# Altium schematic sheet SWAP_21DK_ LV_SR_Brush_Rev1.0.SchDoc
size Letter
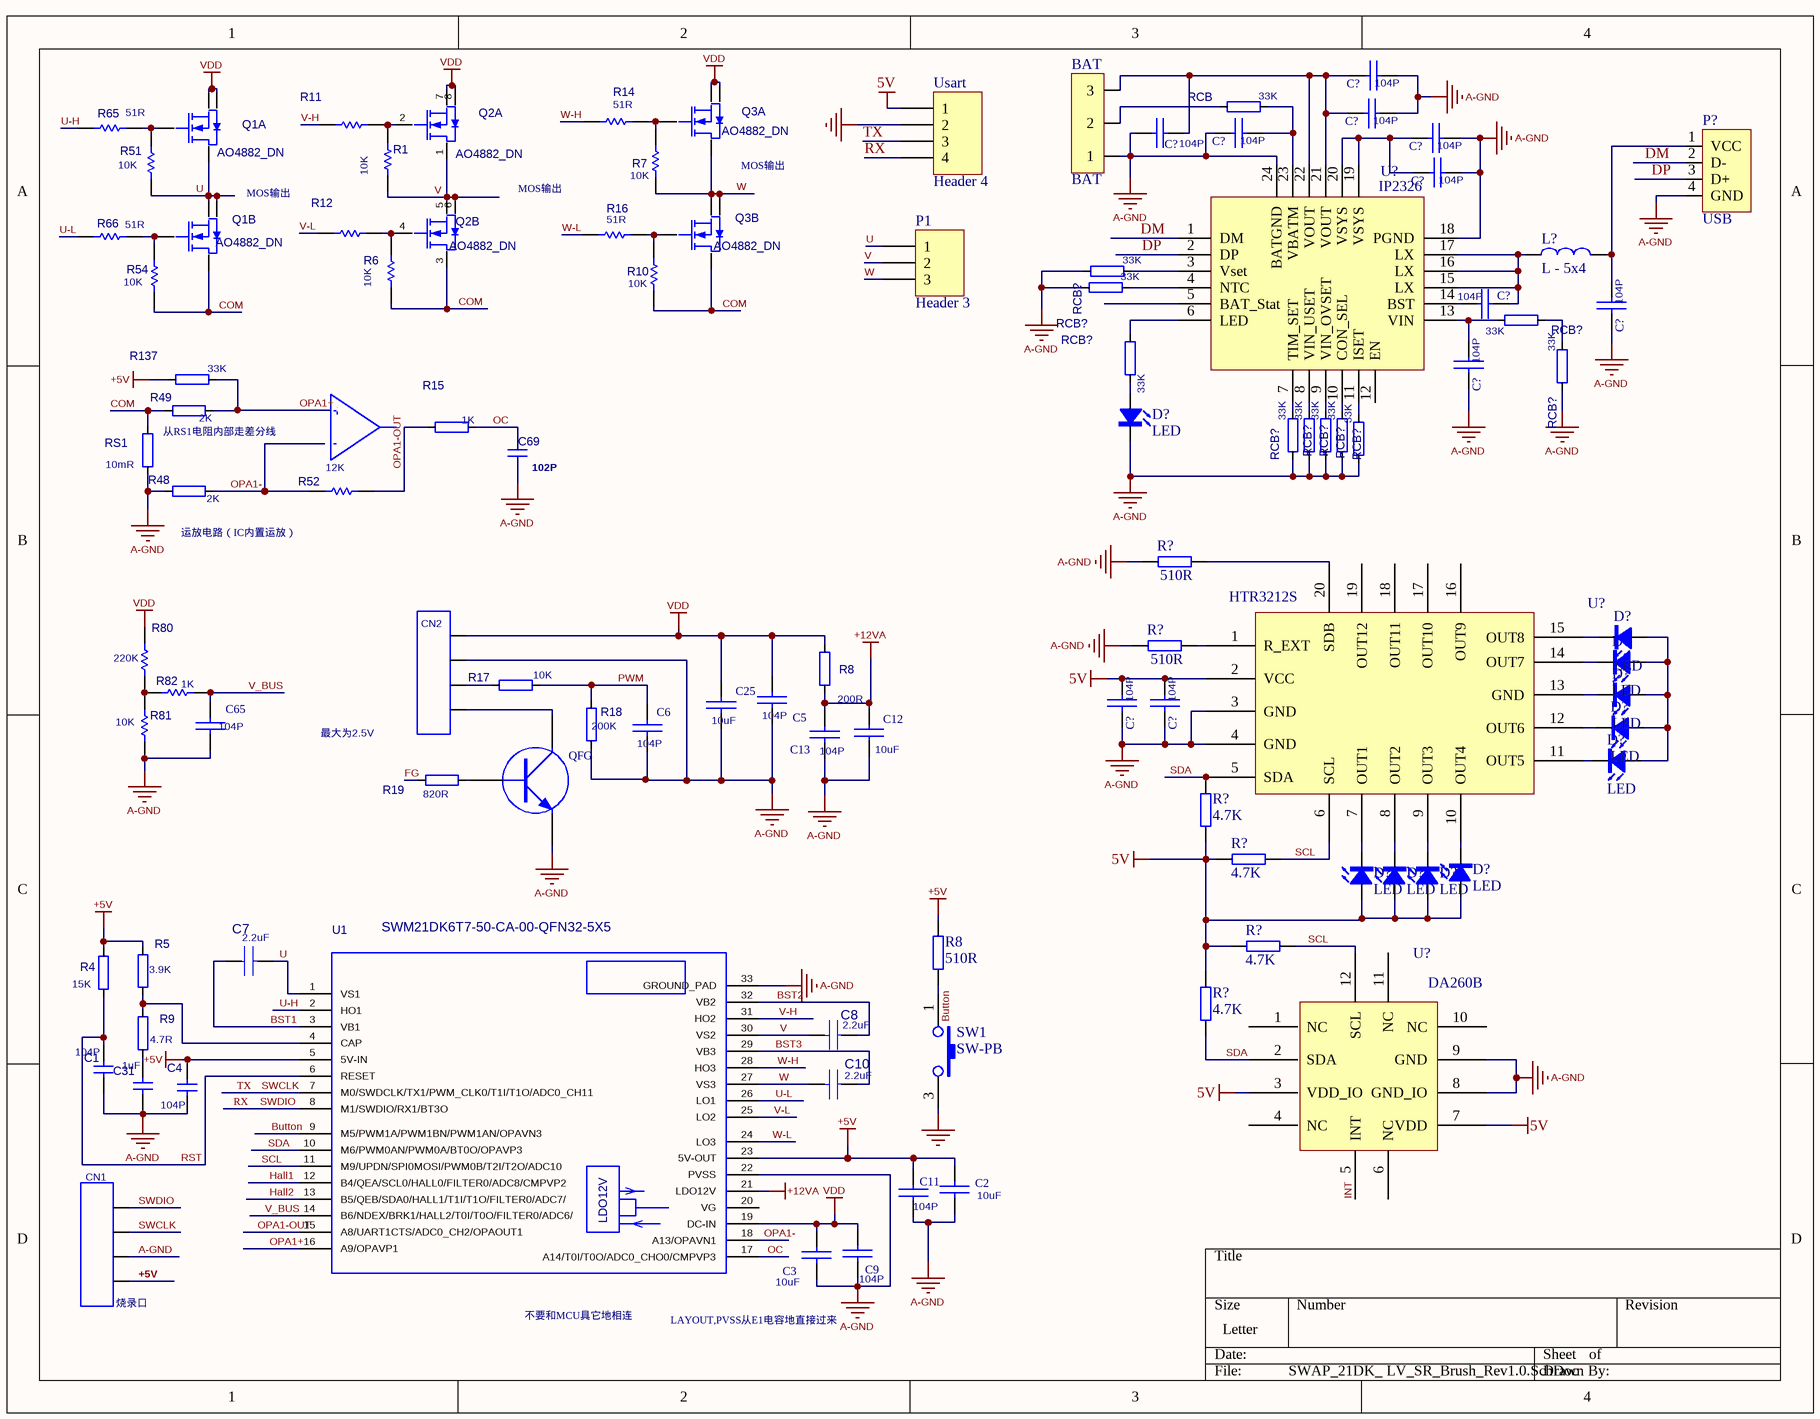
[diagram p0: SWAP_21DK_ LV_SR_Brush_Rev1.0.SchDoc]

## Parts
(Parts that share a designator on the sheet are numbered #1, #2 ... from top to bottom, then left to right.)
BAT  BAT  [HDR1X3]
C1  104P  [LC-0603_R]
C2  10uF  [LC-0603_R]
C3  10uF  [LC-0805_C]
C4  104P  [LC-0603_R]
C5  104P  [LC-0603_R]
C6  104P  [LC-0603_R]
C7  2.2uF  [LC-0603_C]
C8  2.2uF  [LC-0603_C]
C9  104P  [LC-0603_R]
C10  2.2uF  [LC-0603_C]
C11  104P  [LC-0603_R]
C12  10uF  [LC-0603_R]
C13  104P  [LC-0603_R]
C25  10uF  [LC-1206_C]
C31  1uF  [LC-0603_R]
C65  104P  [LC-0603_R]
C69  102P  [LC-0603_R]
C?#1  104P  [LC-0603_R]
C?#2  104P  [LC-0603_R]
C?#3  104P  [LC-0603_R]
C?#4  104P  [LC-0603_R]
C?#5  104P  [LC-0603_R]
C?#6  104P  [LC-0603_R]
C?#7  104P  [LC-0603_R]
C?#8  104P  [LC-0603_R]
C?#9  104P  [LC-0603_R]
C?#10  104P  [LC-0603_R]
C?#11  104P  [LC-0603_R]
CN1  4P-2.54-8B  [HDR2.54-LI-4P]  (value not drawn)
CN2  4P-2.54-8A  [XH2.54-LI-4P]  (value not drawn)
D?#1  LED  [D0603-B]
D?#2  LED  [D0603-B]
D?#3  LED  [D0603-B]
D?#4  LED  [D0603-B]
D?#5  LED  [D0603-B]
D?#6  LED  [D0603-B]
D?#7  LED  [D0603-B]
D?#8  LED  [D0603-B]
D?#9  LED  [D0603-B]
D?#10  LED  [D0603-B]
L?  L - 5x4  [L-5X4]
P1  Header 3  [VH3.96-LI-3P]
P?  USB  [mini_USB]
Q1  AO4882_DN  [LC-SOP-8_150mil]  (parts A,B of 2)
Q2  AO4882_DN  [LC-SOP-8_150mil]  (parts A,B of 2)
Q3  AO4882_DN  [LC-SOP-8_150mil]  (parts A,B of 2)
QFG  NPN 8050  [LC-SOT-23(SOT-23-3)]  (value not drawn)
R1  10K  [LC-0603_R]
R4  15K  [LC-0603_R]
R5  3.9K  [LC-0603_R]
R6  10K  [LC-0603_R]
R7  10K  [LC-0603_R]
R8#1  200R  [LC-1206_R]
R8#2  510R  [R 0603]
R9  4.7R  [LC-0603_R]
R10  10K  [LC-0603_R]
R11  51R  [LC-0603_R]  (value not drawn)
R12  51R  [LC-0603_R]  (value not drawn)
R14  51R  [LC-0603_R]
R15  1K  [LC-0603_R]
R16  51R  [LC-0603_R]
R17  10K  [LC-0603_R]
R18  200K  [LC-0603_R]
R19  820R  [LC-0603_R]
R48  2K  [LC-0603_R]
R49  2K  [LC-0603_R]
R51  10K  [LC-0603_R]
R52  12K  [LC-0603_R]
R54  10K  [LC-0603_R]
R65  51R  [LC-0603_R]
R66  51R  [LC-0603_R]
R80  220K  [LC-0603_R]
R81  10K  [LC-0603_R]
R82  1K  [LC-0603_R]
R137  33K  [LC-0603_R]
R?#1  510R  [R 0603]
R?#2  510R  [R 0603]
R?#3  4.7K  [R 0603]
R?#4  4.7K  [R 0603]
R?#5  4.7K  [R 0603]
R?#6  4.7K  [R 0603]
RCB  33K  [LC-0603_R]
RCB?#1  33K  [LC-0603_R]
RCB?#2  33K  [LC-0603_R]
RCB?#3  33K  [LC-0603_R]
RCB?#4  33K  [LC-0603_R]
RCB?#5  33K  [LC-0603_R]
RCB?#6  33K  [LC-0603_R]
RCB?#7  33K  [LC-0603_R]
RCB?#8  33K  [LC-0603_R]
RCB?#9  33K  [LC-0603_R]
RCB?#10  33K  [LC-0603_R]
RS1  10mR  [LC-1206_R]
SW1  SW-PB  [SW]
U1  QFN32  [QFN32]  (value not drawn)
U?#1  IP2326  [QFN-24]
U?#2  HTR3212S  [SOP-20]
U?#3  DA260B  [SOIC-16]
Usart  Header 4  [2.54-4]

## Nets
5V: C?#10.1 C?#11.1 D?#7.A D?#8.A D?#9.A D?#10.A R?#3.2 R?#4.1 R?#5.1 R?#6.2 U?#2.2(VCC) U?#3.3(VDD_IO) U?#3.7(VDD) Usart.1
+5V: C2.1 C4.1 C11.2 CN1.1 R4.1 R5.1 R8#2.1 R137.2 U1.5(5V-IN) U1.23(5V-OUT)
+12VA: C12.2 C13.2 R8#1.1 U1.21(LDO12V)
A-GND: BAT.1 C1.1 C2.2 C3.1 C4.2 C5.1 C6.1 C9.1 C11.1 C12.1 C13.1 C25.1 C31.1 C65.2 C69.1 C?#1.1 C?#2.1 C?#3.2 C?#4.2 C?#5.1 C?#6.1 C?#7.2 C?#9.2 C?#10.2 C?#11.2 CN1.2 CN2.2 D?#1.K P?.4(GND) QFG.2(E) R18.2 R48.2 R81.2 R?#1.2 R?#2.2 RCB?#1.2 RCB?#2.2 RCB?#4.2 RCB?#6.2 RCB?#7.2 RCB?#8.2 RCB?#9.2 RCB?#10.2 RS1.2 U1.22(PVSS) U1.33(GROUND_PAD) U?#1.18(PGND) U?#1.24(BATGND) U?#2.3(GND) U?#2.4(GND) U?#3.8(GND_IO) U?#3.9(GND)
GND: SW1.3 Usart.2
VDD: C3.2 C5.2 C9.2 C25.2 CN2.1 Q1.7(D) Q1.8(D) Q2.7(D) Q2.8(D) Q3.7(D) Q3.8(D) R8#1.2 R80.2 U1.19(DC-IN)
BST1: C7.1 U1.3(VB1)
BST2: C8.1 U1.32(VB2)
BST3: C10.1 U1.29(VB3)
Button: R8#2.2 SW1.1 U1.9(M5/PWM1A/PWM1BN/PWM1AN/OPAVN3)
COM: Q1.3(S) Q2.3(S) Q3.3(S) R6.1 R10.1 R49.2 R54.1 RS1.1
DM: P?.2(D-) U?#1.1(DM)
DP: P?.3(D+) U?#1.2(DP)
FG: R19.2
Hall1: U1.12(B4/QEA/SCL0/HALL0/FILTER0/ADC8/CMPVP2)
Hall2: U1.13(B5/QEB/SDA0/HALL1/T1I/T1O/FILTER0/ADC7/)
INT: U?#3.5(INT)
OC: C69.2 R15.1 U1.17(A14/T0I/T0O/ADC0_CHO0/CMPVP3)
OPA1+: R49.1 R137.1 U1.16(A9/OPAVP1)
OPA1-: R48.1 R52.1 U1.18(A13/OPAVN1)
OPA1-OUT: R15.2 R52.2 U1.15(A8/UART1CTS/ADC0_CH2/OPAOUT1)
PWM: C6.2 R17.1 R18.1
RST: C1.2 R4.2 U1.6(RESET)
RX: CN1.4 U1.8(M1/SWDIO/RX1/BT3O) Usart.4  [also labelled SWDIO]
SCL: R?#4.2 R?#5.2 U1.11(M9/UPDN/SPI0MOSI/PWM0B/T2I/T2O/ADC10) U?#2.6(SCL) U?#3.12(SCL)
SDA: R?#3.1 R?#6.1 U1.10(M6/PWM0AN/PWM0A/BT0O/OPAVP3) U?#2.5(SDA) U?#3.2(SDA)
SWCLK: CN1.3 U1.7(M0/SWDCLK/TX1/PWM_CLK0/T1I/T1O/ADC0_CH11) Usart.3  [also labelled TX]
U: C7.2 P1.1 Q1.1(S) Q1.5(D) Q1.6(D) R51.1 U1.1(VS1)
U-H: R65.1 U1.2(HO1)
U-L: R66.1 U1.26(LO1)
V: C8.2 P1.2 Q2.1(S) Q2.5(D) Q2.6(D) R1.1 U1.30(VS2)
V-H: R11.1 U1.31(HO2)
V-L: R12.1 U1.25(LO2)
V_BUS: C65.1 R82.1 U1.14(B6/NDEX/BRK1/HALL2/T0I/T0O/FILTER0/ADC6/)
W: C10.2 P1.3 Q3.1(S) Q3.5(D) Q3.6(D) R7.1 U1.27(VS3)
W-H: R14.1 U1.28(HO3)
W-L: R16.1 U1.24(LO3)
NetBAT_2: BAT.2 RCB.2
NetBAT_3: BAT.3 C?#1.2 C?#2.2 C?#3.1 U?#1.21(VOUT) U?#1.22(VOUT)
NetC31_2: C31.2 R9.2
NetC?#4_1: C?#4.1 RCB.1 U?#1.23(VBATM)
NetC?#5_2: C?#5.2 C?#6.2 U?#1.19(VSYS) U?#1.20(VSYS)
NetC?#7_1: C?#7.1 L?.1 P?.1(VCC)
NetC?#8_1: C?#8.1 U?#1.14(BST)
NetC?#8_2: C?#8.2 L?.2 U?#1.15(LX) U?#1.16(LX) U?#1.17(LX)
NetC?#9_1: C?#9.1 RCB?#3.1 U?#1.13(VIN)
NetCN2_3: CN2.3 R17.2
NetCN2_4: CN2.4 QFG.3(C)
NetD?#1_A: D?#1.A RCB?#5.1
NetD?#2_A: D?#2.A D?#3.A D?#4.A D?#5.A D?#6.A
NetD?#2_K: D?#2.K U?#2.15(OUT8)
NetD?#3_K: D?#3.K U?#2.14(OUT7)
NetD?#4_K: D?#4.K U?#2.13(GND)
NetD?#5_K: D?#5.K U?#2.12(OUT6)
NetD?#6_K: D?#6.K U?#2.11(OUT5)
NetD?#7_K: D?#7.K U?#2.10(OUT4)
NetD?#8_K: D?#8.K U?#2.7(OUT1)
NetD?#9_K: D?#9.K U?#2.8(OUT2)
NetD?#10_K: D?#10.K U?#2.9(OUT3)
NetQ1_2: Q1.2(G) R51.2 R65.2
NetQ1_4: Q1.4(G) R54.2 R66.2
NetQ2_2: Q2.2(G) R1.2 R11.2
NetQ2_4: Q2.4(G) R6.2 R12.2
NetQ3_2: Q3.2(G) R7.2 R14.2
NetQ3_4: Q3.4(G) R10.2 R16.2
NetQFG_1: QFG.1(B) R19.1
NetR5_2: R5.2 R9.1 U1.4(CAP)
NetR80_1: R80.1 R81.1 R82.2
NetR?#1_1: R?#1.1 U?#2.20(SDB)
NetR?#2_1: R?#2.1 U?#2.1(R_EXT)
NetRCB?#1_1: RCB?#1.1 U?#1.3(Vset)
NetRCB?#2_1: RCB?#2.1 U?#1.4(NTC)
NetRCB?#3_2: RCB?#3.2 RCB?#4.1
NetRCB?#5_2: RCB?#5.2 U?#1.6(LED)
NetRCB?#6_1: RCB?#6.1 U?#1.7(TIM_SET)
NetRCB?#7_1: RCB?#7.1 U?#1.8(VIN_USET)
NetRCB?#8_1: RCB?#8.1 U?#1.9(VIN_OVSET)
NetRCB?#9_1: RCB?#9.1 U?#1.10(CON_SEL)
NetRCB?#10_1: RCB?#10.1 U?#1.11(ISET)

Not connected (* = marked no-connect by the designer): U1 20(VG); U?#1 5(BAT_Stat) 12(EN); U?#2 16(OUT9) 17(OUT10) 18(OUT11) 19(OUT12); U?#3 1(NC) 4(NC) 6(NC) 10(NC) 11(NC)

## Notes on the sheet
- (near Q1) MOS输出
- MOS输出
- (near Q3) MOS输出
- 从RS1电阻内部走差分线
- (near R48) 运放电路（IC内置运放）
- 最大为2.5V
- (near CN1) 烧录口
- (near U1) 不要和MCU具它地相连
- LAYOUT,PVSS从E1电容地直接过来
- (in symbol SWM21DK6U7_QFN32_5X5_BA00) SWM21DK6T7-50-CA-00-QFN32-5X5

## Library data of the parts
BAT = BAT: Connector
C1 C4 C31 = CAP_S: PCB DECAL: C_0402
C2 = CC: Capacitor; PCB DECAL: C0805
C3 C12 C25 = CC: Capacitor; PCB DECAL: C1206
C5 C6 C13 C?#1-C?#11 = CC: Capacitor; PCB DECAL: C0603
C7 C8 C10 = C0805: Capacitor; Part_Shape: 0603; Source_Path: E:\GTCS-A01-SWM-P9项目\GTCS-A01-SWM-P9项目V1.2\GTCS-A01-SWM-P9-V1.2.原理图\99.DSN; Published: 8-Jun-2000; LatestRevisionDate: 17-Jul-2002; LatestRevisionNote: Re-released for DXP Platform.; PackageReference: RAD-0.3; Publisher: Altium Limited; PackageDescription: Radial Cap, Thru-Hole; 2 Leads; 0.3 in Pin Spacing; Value: 2.2uF; PCB DECAL: C0805
C9 C11 = CC: Capacitor; PCB DECAL: C0805; SMD/DIP/WELDING: SMD
C65 = CC: Capacitor; Value: 100pF; PCB DECAL: C0603; Published: 8-Jun-2000; LatestRevisionDate: 17-Jul-2002; LatestRevisionNote: Re-released for DXP Platform.; PackageReference: RAD-0.3; Publisher: Altium Limited; PackageDescription: Radial Cap, Thru-Hole; 2 Leads; 0.3 in Pin Spacing
C69 = C0603: 贴片瓷片电容; Value: 100nF; Published: 8-Jun-2000; LatestRevisionDate: 17-Jul-2002; LatestRevisionNote: Re-released for DXP Platform.; PackageReference: RAD-0.3; Publisher: Altium Limited; PCB DECAL: C0603
CN1 CN2 = 4P-2.54-8: 接插件  DS-5.1CN4  DS-2.54CWB-4; PCB DECAL: 4P-2.54-8
L? = L - 5x4: 电感
P1 = Header 3: Header, 3-Pin; LatestRevisionDate: 17-Jul-2002; LatestRevisionNote: Re-released for DXP Platform.; Publisher: Altium Limited
P? = USB: USB 1.1, Right Angle, SMT, A Type, Plug, 4 Position, Natural; ContactMaterial: Brass; ContactPlating: Gold (30) over Nickel (50); PCB_Layout: Complies with manufacturer's recommendation.; DrillSize: Corresponds to nominal value.; PanelGround: Without; Published: 15-Jul-2004; DatasheetDocument: 21-Jan-2003; PackageDocument: 21-Jan-2003; PackageReference: 1470695A; Publisher: Altium Limited; HousingMaterial: Thermoplastic; ComponentLink1Description: Manufacturer Link; ComponentLink1URL: http://www.tycoelectronics.com/; ComponentLink2Description: Packaging Specification; ComponentLink2URL: http://ecommas.tycoelectronics.com/commerce/DocumentDelivery/DDEController?Action=showdoc&DocId=Customer+Drawing%7F1470695%7FO%7Fpdf%7FEnglish%7FC_1470695_O.pdf
Q1-Q3 = AO4882_DN_SOP8: MOS(场效应管)
QFG = NPN: NPN Transistor; PCB DECAL: SOT-23/SOT-23-3
R1 R6 R7 R10-R12 R14 R16 R51 R52 R54 R65 R66 R80 R81 = RES_SEMI: Semiconductor Resistor; Value: 1K; PCB DECAL: R0603; Published: 8-Jun-2000; LatestRevisionDate: 17-Jul-2002; LatestRevisionNote: Re-released for DXP Platform.; PackageReference: AXIAL-0.5; Publisher: Altium Limited; PackageDescription: Axial Device, Thru-Hole; 2 Leads; 0.5 in Pin Spacing
R4 R5 R9 = RR: 贴片 电阻器; PCB DECAL: R0402; SMD/DIP/WELDING: SMD
R8#1 = RR: 贴片 电阻器; Value: 1K; PCB DECAL: R0402; SMD/DIP/WELDING: SMD; Published: 8-Jun-2000; LatestRevisionDate: 17-Jul-2002; LatestRevisionNote: Re-released for DXP Platform.; PackageReference: AXIAL-0.5; Publisher: Altium Limited; PackageDescription: Axial Device, Thru-Hole; 2 Leads; 0.5 in Pin Spacing
R8#2 R?#1-R?#6 = R: Resistance
R15 = RR: 贴片 电阻器; PCB DECAL: R0603; SMD/DIP/WELDING: SMD; Published: 8-Jun-2000; LatestRevisionDate: 17-Jul-2002; LatestRevisionNote: Re-released for DXP Platform.; PackageReference: AXIAL-0.5; Publisher: Altium Limited; PackageDescription: Axial Device, Thru-Hole; 2 Leads; 0.5 in Pin Spacing; Value: 1K
R17-R19 = RR: 贴片 电阻器; PCB DECAL: R1206; SMD/DIP/WELDING: SMD; ComponentLink1Description: 供应商链接; ComponentLink1URL: http://www.szlcsc.com/product/details_18589.html; Package: 1206; Supplier: LC; SuppliersPartNumber: C17901
R48 R49 R137 RCB RCB?#1-RCB?#10 = RR: 贴片 电阻器; Value: 1K; PCB DECAL: R0603; SMD/DIP/WELDING: SMD; Published: 8-Jun-2000; LatestRevisionDate: 17-Jul-2002; LatestRevisionNote: Re-released for DXP Platform.; PackageReference: AXIAL-0.5; Publisher: Altium Limited; PackageDescription: Axial Device, Thru-Hole; 2 Leads; 0.5 in Pin Spacing
R82 = RES_SEMI: Semiconductor Resistor; PCB DECAL: R0603; Published: 8-Jun-2000; LatestRevisionDate: 17-Jul-2002; LatestRevisionNote: Re-released for DXP Platform.; PackageReference: AXIAL-0.5; Publisher: Altium Limited; PackageDescription: Axial Device, Thru-Hole; 2 Leads; 0.5 in Pin Spacing; Value: 1K
RS1 = RR: 贴片 电阻器; Value: 1K; PCB DECAL: 1206R; SMD/DIP/WELDING: SMD; Published: 8-Jun-2000; LatestRevisionDate: 17-Jul-2002; LatestRevisionNote: Re-released for DXP Platform.; PackageReference: AXIAL-0.5; Publisher: Altium Limited; PackageDescription: Axial Device, Thru-Hole; 2 Leads; 0.5 in Pin Spacing
U1 = SWM21DK6U7_QFN32_5X5_BA00: 微控制器, Cortex-M0系列; PCB DECAL: SWM21DK6U7_QFN32_5X5_BA00
Usart = Header 4: Header, 4-Pin; LatestRevisionDate: 17-Jul-2002; LatestRevisionNote: Re-released for DXP Platform.; Publisher: Altium Limited